# Altium project Power_management.PrjPcb
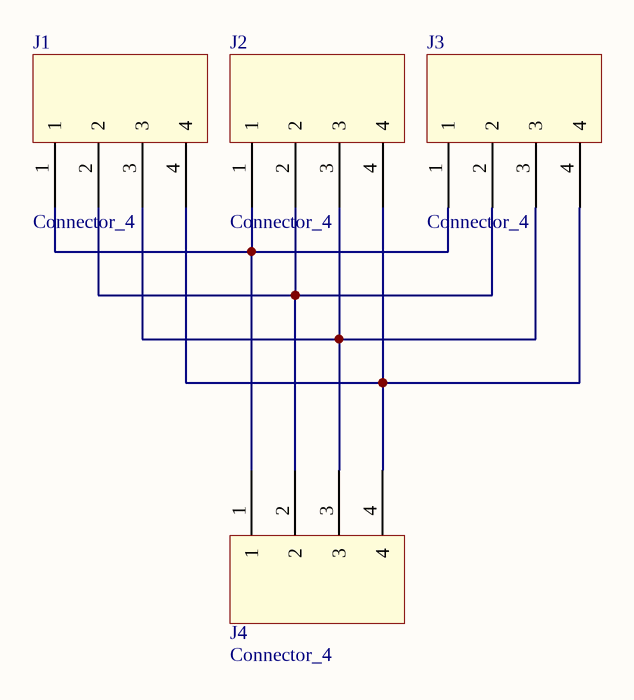
[diagram p0: Sheet1.SchDoc]
1 sheet, 4 parts. Net scope: global (net labels, ports and power ports of the same name join across sheets).
Board file: PCB1.PcbDoc

## Sheet Sheet1.SchDoc
size A4; SheetNumber: 1; SheetTotal: 1

### Parts
J1  Connector_4  [PTSM 0,5/ 4-HHI-2,5-THR WH R32]
J2  Connector_4  [PTSM 0,5/ 4-HHI-2,5-THR WH R32]
J3  Connector_4  [PTSM 0,5/ 4-HHI-2,5-THR WH R32]
J4  Connector_4  [PTSM 0,5/ 4-2,5-H THR WH R32]

### Nets
NetJ1_1: J1.1 J2.1 J3.1 J4.1
NetJ1_2: J1.2 J2.2 J3.2 J4.2
NetJ1_3: J1.3 J2.3 J3.3 J4.3
NetJ1_4: J1.4 J2.4 J3.4 J4.4